# Altium project PCB_Clock.PrjPCB
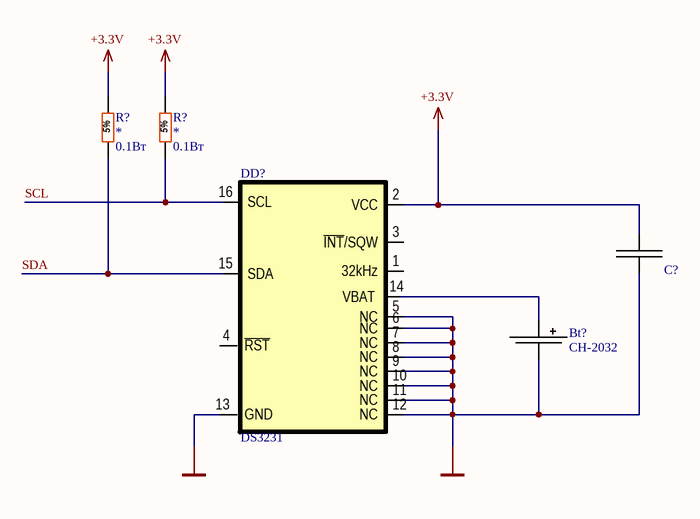
[diagram p0: clock_DS.SchDoc]
4 sheets, 118 parts. Net scope: global (net labels, ports and power ports of the same name join across sheets).
Sheets:
  clock_DS.SchDoc
  LED_MAX.SchDoc
  MPU_SHC.SchDoc
  DC_DCConverter.SchDoc

## Sheet clock_DS.SchDoc
size 209 x 297 mm; Address1: Address1; Address2: Address2; Address3: Address3; Address4: Address4; SheetNumber: 1; Scale: 1:1; Разраб.: Иванов; Обозначение документа: АБВГ.123456.001 Э3; Пров.: Петров; Утв.: Сидоров; Наименование организации: ОАО "Концерн "МПО-Гидроприбор"; Перв. применение: АБВГ.123456.000; Наименование изделия 1: Плата; Наименование изделия 2: Схема электрическая; Наименование изделия 3: принципиальная; Нач. отд.: Нач. отд.; Фамилия нач. отд.: Сидоров

### Parts
(Parts that share a designator on the sheet are numbered #1, #2 ... from top to bottom, then left to right.)
Bt?  CH-2032  [CH25-2032]
C?#1  *  [CH0603L]  (value not drawn)
DD?#1  DS3231  [16-SOIC (W)]
R?#1  Power: 0.1Вт  [Res0603]  (hidden comment: *)
R?#2  Power: 0.1Вт  [Res0603]  (hidden comment: *)

### Nets
+3.3V: C?#1.1 DD?#1.2(VCC) R?#1.2 R?#2.2
GND: Bt?.2 C?#1.2 DD?#1.5(NC) DD?#1.6(NC) DD?#1.7(NC) DD?#1.8(NC) DD?#1.9(NC) DD?#1.10(NC) DD?#1.11(NC) DD?#1.12(NC) DD?#1.13(GND)
SCL: DD?#1.16(SCL) R?#2.1
SDA: DD?#1.15(SDA) R?#1.1
NetBt?_1: Bt?.1 DD?#1.14(VBAT)

Not connected (* = marked no-connect by the designer): DD?#1 1(32kHz) 3(~{INT}/SQW) 4(~{RST})

### Notes on the sheet
- Перв. примен.
- Справ. №
- Подп. и дата
- Инв. № дубл.
- Взам. инв. №
- Разраб.
- Изм.
- Лист
- № докум.
- Подп.
- Дата
- Лит.
- Масса
- Масштаб
- Пров.
- Т.контр.
- Листов
- Инв. № подл.
- Утв.
- Н.контр.
- 2.106-A4
- Копировал
- Формат А4

### Library data of the parts
Bt? = CR-2032: Value: *; Quantity: *; Part Number: *; Manufacturer: *; Package: *; Price: *; ShoppingPlace: *; Documentation: *; Type: Bt
C?#1 = Capasitor: Value: *; Voltage: *; Part Number: *; Quantity: *; Package: *; Price: *; Manufacturer: *; ShoppingPlace: *
DD?#1 = DS3231: Manufacturer: MAXIM; Part Number: DS3231; Package: SO-16; Quantity: 1; Tolerance: *; Type: IC; Voltage: *; Power: *
R?#1 R?#2 = Res0603_5%: Voltage: 50В; Tolerance: 5%; Manufacturer: *; Quntity: *; Price: *; Part Number: *; Package: 0603; Doc: *; Value: *

## Sheet LED_MAX.SchDoc
size 420 x 297 mm; Address1: Address1; Address2: Address2; Address3: Address3; Address4: Address4; SheetNumber: 1; Scale: 1:1; Разраб.: Иванов; Обозначение документа: АБВГ.123456.001 Э3; Пров.: Петров; Утв.: Сидоров; Наименование организации: ОАО "Концерн "МПО-Гидроприбор"; Перв. применение: АБВГ.123456.000; Наименование изделия 1: Плата; Наименование изделия 2: Схема электрическая; Наименование изделия 3: принципиальная; Нач. отд.: Нач. отд.; Фамилия нач. отд.: Сидоров
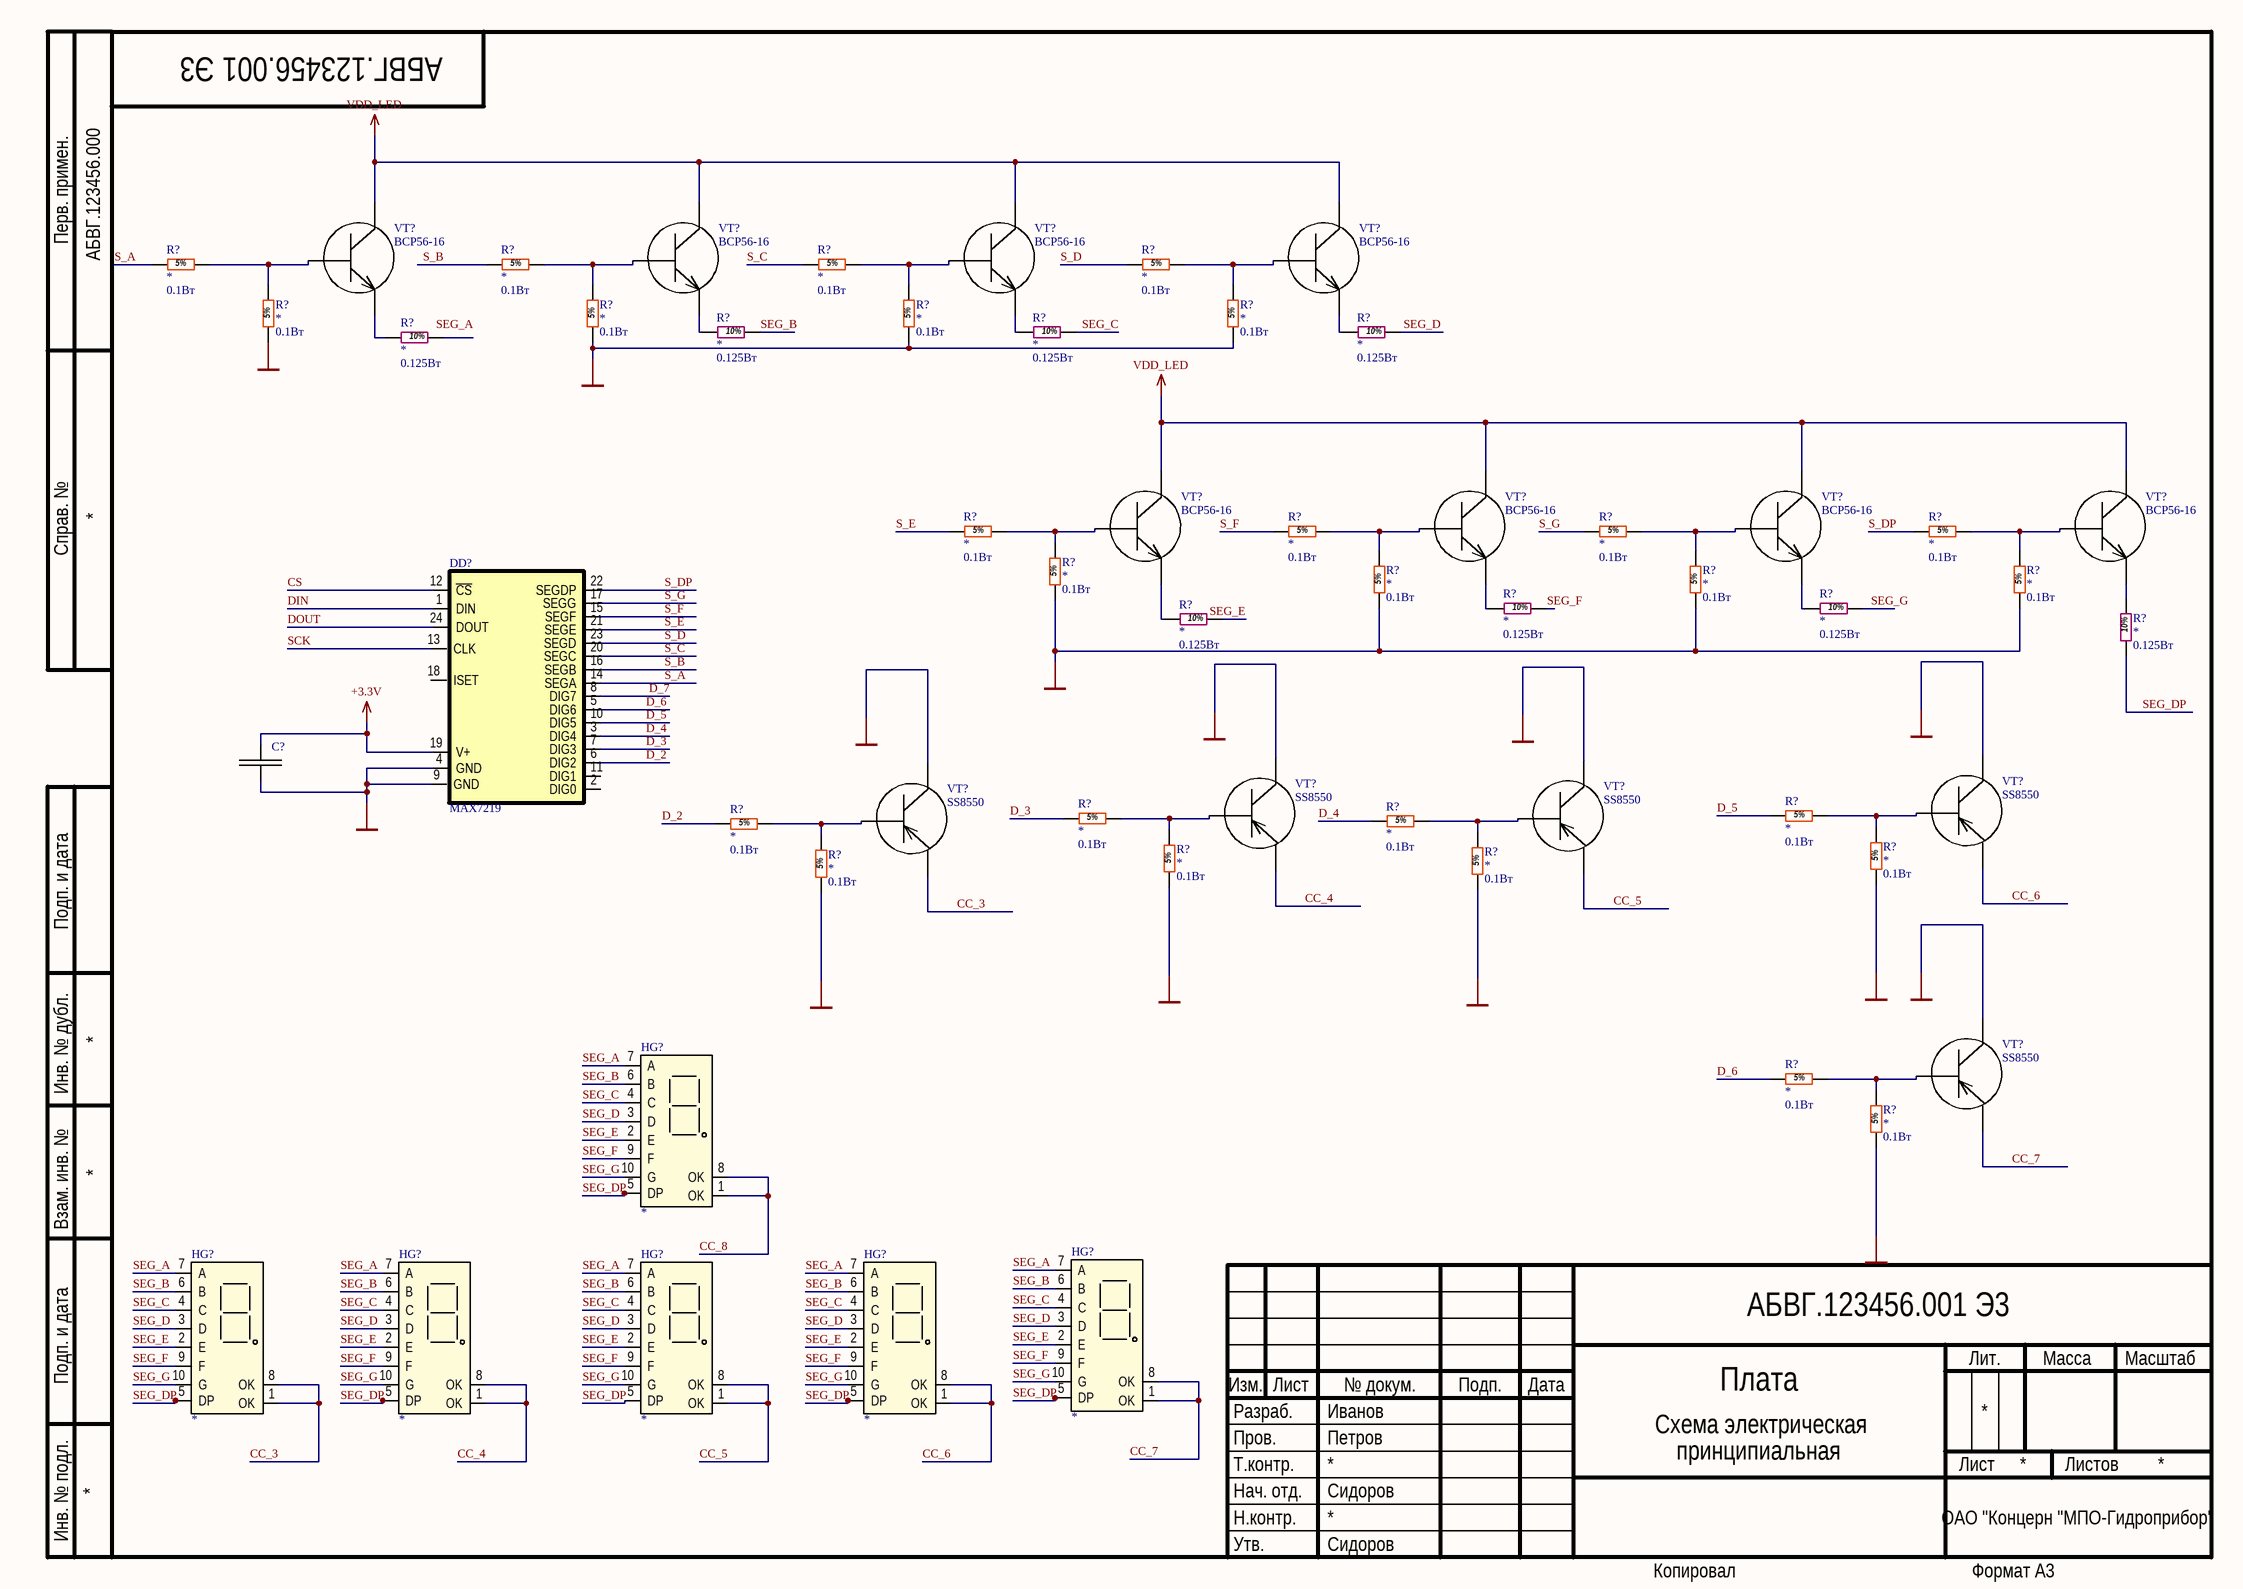
[diagram p1: LED_MAX.SchDoc]

### Parts
(Parts that share a designator on the sheet are numbered #1, #2 ... from top to bottom, then left to right.)
C?#2  *  [CH0603L]  (value not drawn)
DD?#2  MAX7219  [SO-24]
HG?#1  *  [FYS-40011]
HG?#2  *  [FYS-40011]
HG?#3  *  [FYS-40011]
HG?#4  *  [FYS-40011]
HG?#5  *  [FYS-40011]
HG?#6  *  [FYS-40011]
R?#3  Power: 0.1Вт  [Res0603]  (hidden comment: *)
R?#4  Power: 0.1Вт  [Res0603]  (hidden comment: *)
R?#5  Power: 0.1Вт  [Res0603]  (hidden comment: *)
R?#6  Power: 0.1Вт  [Res0603]  (hidden comment: *)
R?#7  Power: 0.1Вт  [Res0603]  (hidden comment: *)
R?#8  Power: 0.1Вт  [Res0603]  (hidden comment: *)
R?#9  Power: 0.1Вт  [Res0603]  (hidden comment: *)
R?#10  Power: 0.1Вт  [Res0603]  (hidden comment: *)
R?#11  Power: 0.125Вт  [RES0805]  (hidden comment: *)
R?#12  Power: 0.125Вт  [RES0805]  (hidden comment: *)
R?#13  Power: 0.125Вт  [RES0805]  (hidden comment: *)
R?#14  Power: 0.125Вт  [RES0805]  (hidden comment: *)
R?#15  Power: 0.1Вт  [Res0603]  (hidden comment: *)
R?#16  Power: 0.1Вт  [Res0603]  (hidden comment: *)
R?#17  Power: 0.1Вт  [Res0603]  (hidden comment: *)
R?#18  Power: 0.1Вт  [Res0603]  (hidden comment: *)
R?#19  Power: 0.1Вт  [Res0603]  (hidden comment: *)
R?#20  Power: 0.1Вт  [Res0603]  (hidden comment: *)
R?#21  Power: 0.1Вт  [Res0603]  (hidden comment: *)
R?#22  Power: 0.1Вт  [Res0603]  (hidden comment: *)
R?#23  Power: 0.125Вт  [RES0805]  (hidden comment: *)
R?#24  Power: 0.125Вт  [RES0805]  (hidden comment: *)
R?#25  Power: 0.125Вт  [RES0805]  (hidden comment: *)
R?#26  Power: 0.125Вт  [RES0805]  (hidden comment: *)
R?#27  Power: 0.1Вт  [Res0603]  (hidden comment: *)
R?#28  Power: 0.1Вт  [Res0603]  (hidden comment: *)
R?#29  Power: 0.1Вт  [Res0603]  (hidden comment: *)
R?#30  Power: 0.1Вт  [Res0603]  (hidden comment: *)
R?#31  Power: 0.1Вт  [Res0603]  (hidden comment: *)
R?#32  Power: 0.1Вт  [Res0603]  (hidden comment: *)
R?#33  Power: 0.1Вт  [Res0603]  (hidden comment: *)
R?#34  Power: 0.1Вт  [Res0603]  (hidden comment: *)
R?#35  Power: 0.1Вт  [Res0603]  (hidden comment: *)
R?#36  Power: 0.1Вт  [Res0603]  (hidden comment: *)
VT?#1  BCP56-16  [SOT223]
VT?#2  BCP56-16  [SOT223]
VT?#3  BCP56-16  [SOT223]
VT?#4  BCP56-16  [SOT223]
VT?#5  BCP56-16  [SOT223]
VT?#6  BCP56-16  [SOT223]
VT?#7  BCP56-16  [SOT223]
VT?#8  BCP56-16  [SOT223]
VT?#9  SS8550  [SOT23-3]
VT?#10  SS8550  [SOT23-3]
VT?#11  SS8550  [SOT23-3]
VT?#12  SS8550  [SOT23-3]
VT?#13  SS8550  [SOT23-3]

### Nets
+3.3V: C?#2.1 DD?#2.19(V+)
GND: C?#2.2 DD?#2.4(GND) DD?#2.9(GND) R?#7.1 R?#8.1 R?#9.1 R?#10.1 R?#19.1 R?#20.1 R?#21.1 R?#22.1 R?#31.1 R?#32.1 R?#33.1 R?#34.1 R?#36.1 VT?#9.3 VT?#10.3 VT?#11.3 VT?#12.3 VT?#13.3
VDD_LED: VT?#1.2 VT?#2.2 VT?#3.2 VT?#4.2 VT?#5.2 VT?#6.2 VT?#7.2 VT?#8.2
CC_3: HG?#2.1(OK) HG?#2.8(OK) VT?#11.2
CC_4: HG?#3.1(OK) HG?#3.8(OK) VT?#9.2
CC_5: HG?#4.1(OK) HG?#4.8(OK) VT?#12.2
CC_6: HG?#5.1(OK) HG?#5.8(OK) VT?#10.2
CC_7: HG?#6.1(OK) HG?#6.8(OK) VT?#13.2
CC_8: HG?#1.1(OK) HG?#1.8(OK)
CS: DD?#2.12(~{CS})
D_2: DD?#2.6(DIG2) R?#28.1
D_3: DD?#2.7(DIG3) R?#29.1
D_4: DD?#2.3(DIG4) R?#30.1
D_5: DD?#2.10(DIG5) R?#27.1
D_6: DD?#2.5(DIG6) R?#35.1
D_7: DD?#2.8(DIG7)
DIN: DD?#2.1(DIN)
DOUT: DD?#2.24(DOUT)
S_A: DD?#2.14(SEGA) R?#3.1
S_B: DD?#2.16(SEGB) R?#4.1
S_C: DD?#2.20(SEGC) R?#5.1
S_D: DD?#2.23(SEGD) R?#6.1
S_DP: DD?#2.22(SEGDP) R?#18.1
S_E: DD?#2.21(SEGE) R?#15.1
S_F: DD?#2.15(SEGF) R?#16.1
S_G: DD?#2.17(SEGG) R?#17.1
SCK: DD?#2.13(CLK)
SEG_A: HG?#1.7(A) HG?#2.7(A) HG?#3.7(A) HG?#4.7(A) HG?#5.7(A) HG?#6.7(A)
SEG_B: HG?#1.6(B) HG?#2.6(B) HG?#3.6(B) HG?#4.6(B) HG?#5.6(B) HG?#6.6(B) R?#12.2
SEG_C: HG?#1.4(C) HG?#2.4(C) HG?#3.4(C) HG?#4.4(C) HG?#5.4(C) HG?#6.4(C) R?#13.2
SEG_D: HG?#1.3(D) HG?#2.3(D) HG?#3.3(D) HG?#4.3(D) HG?#5.3(D) HG?#6.3(D) R?#14.2
SEG_DP: HG?#1.5(DP) HG?#2.5(DP) HG?#3.5(DP) HG?#4.5(DP) HG?#5.5(DP) HG?#6.5(DP) R?#26.1
SEG_E: HG?#1.2(E) HG?#2.2(E) HG?#3.2(E) HG?#4.2(E) HG?#5.2(E) HG?#6.2(E)
SEG_F: HG?#1.9(F) HG?#2.9(F) HG?#3.9(F) HG?#4.9(F) HG?#5.9(F) HG?#6.9(F) R?#23.2
SEG_G: HG?#1.10(G) HG?#2.10(G) HG?#3.10(G) HG?#4.10(G) HG?#5.10(G) HG?#6.10(G) R?#24.2
NetR?#3_2: R?#3.2 R?#7.2 VT?#1.1
NetR?#4_2: R?#4.2 R?#8.2 VT?#2.1
NetR?#5_2: R?#5.2 R?#9.2 VT?#3.1
NetR?#6_2: R?#6.2 R?#10.2 VT?#4.1
NetR?#11_1: R?#11.1 VT?#1.3
NetR?#12_1: R?#12.1 VT?#2.3
NetR?#13_1: R?#13.1 VT?#3.3
NetR?#14_1: R?#14.1 VT?#4.3
NetR?#15_2: R?#15.2 R?#19.2 VT?#5.1
NetR?#16_2: R?#16.2 R?#20.2 VT?#6.1
NetR?#17_2: R?#17.2 R?#21.2 VT?#7.1
NetR?#18_2: R?#18.2 R?#22.2 VT?#8.1
NetR?#23_1: R?#23.1 VT?#6.3
NetR?#24_1: R?#24.1 VT?#7.3
NetR?#25_1: R?#25.1 VT?#5.3
NetR?#26_2: R?#26.2 VT?#8.3
NetR?#27_2: R?#27.2 R?#32.2 VT?#10.1
NetR?#28_2: R?#28.2 R?#33.2 VT?#11.1
NetR?#29_2: R?#29.2 R?#31.2 VT?#9.1
NetR?#30_2: R?#30.2 R?#34.2 VT?#12.1
NetR?#35_2: R?#35.2 R?#36.2 VT?#13.1

Not connected (* = marked no-connect by the designer): DD?#2 2(DIG0) 11(DIG1) 18(ISET); R?#11 2; R?#25 2

### Notes on the sheet
- Labels drawn without touching a wire or pin: SEG_A, SEG_E
- Перв. примен.
- Справ. №
- Подп. и дата
- Инв. № дубл.
- Взам. инв. №
- Разраб.
- Изм.
- Лист
- № докум.
- Подп.
- Дата
- Лит.
- Масса
- Масштаб
- Пров.
- Т.контр.
- Листов
- Инв. № подл.
- Утв.
- Н.контр.
- Копировал
- Формат А3

### Library data of the parts
C?#2 = Capasitor: Value: *; Voltage: *; Part Number: *; Quantity: *; Package: *; Price: *; Manufacturer: *; ShoppingPlace: *
DD?#2 = MAX7219: Manufacturer: MAXIM; Part Number: MAX7219; Package: SO-24; Quantity: 1; Tolerance: *; Type: IC; Voltage: *; Power: *
HG?#1-HG?#6 = LED Indicator: Value: *; Quantity: *; Part Number: *; Manufacturer: *; Package: *; Price: *; ShoppingPlace: *; Documentation: *; Type: HG
R?#3-R?#10 R?#15-R?#22 R?#27-R?#36 = Res0603_5%: Voltage: 50В; Tolerance: 5%; Manufacturer: *; Quntity: *; Price: *; Part Number: *; Package: 0603; Doc: *; Value: *
R?#11-R?#14 R?#23-R?#26 = Res0805_10%: Voltage: 150В; Tolerance: 10%; Manufacturer: *; Quntity: *; Price: *; Part Number: *; Package: 0805; Doc: *; Value: *
VT?#1-VT?#8 = BCP56-16: Manufacturer: NXP Semiconductors; Value: 80V,1A; Part Number: BCP56-16; Price: BCP56; Quantity: 2; Documentation: https://assets.nexperia.com/documents/data-sheet/BCP56_BCX56_BC56PA.pdf
VT?#9-VT?#13 = SS8550: Manufacturer: NXP; Value: 45V,100mA; Part Number: SS8550; Price: 1; ShoppingPlace: https://belchip.by/product/?selected_product=29133; Quantity: 1; Package: SOT-23; Documentation: https://belchip.by/sitedocs/ss8550.pdf

## Sheet MPU_SHC.SchDoc
size 420 x 297 mm; Address1: Address1; Address2: Address2; Address3: Address3; Address4: Address4; SheetNumber: 1; Scale: 1:1; Разраб.: Иванов; Обозначение документа: АБВГ.123456.001 Э3; Пров.: Петров; Утв.: Сидоров; Наименование организации: ОАО "Концерн "МПО-Гидроприбор"; Перв. применение: АБВГ.123456.000; Наименование изделия 1: Плата; Наименование изделия 2: Схема электрическая; Наименование изделия 3: принципиальная; Нач. отд.: Нач. отд.; Фамилия нач. отд.: Сидоров
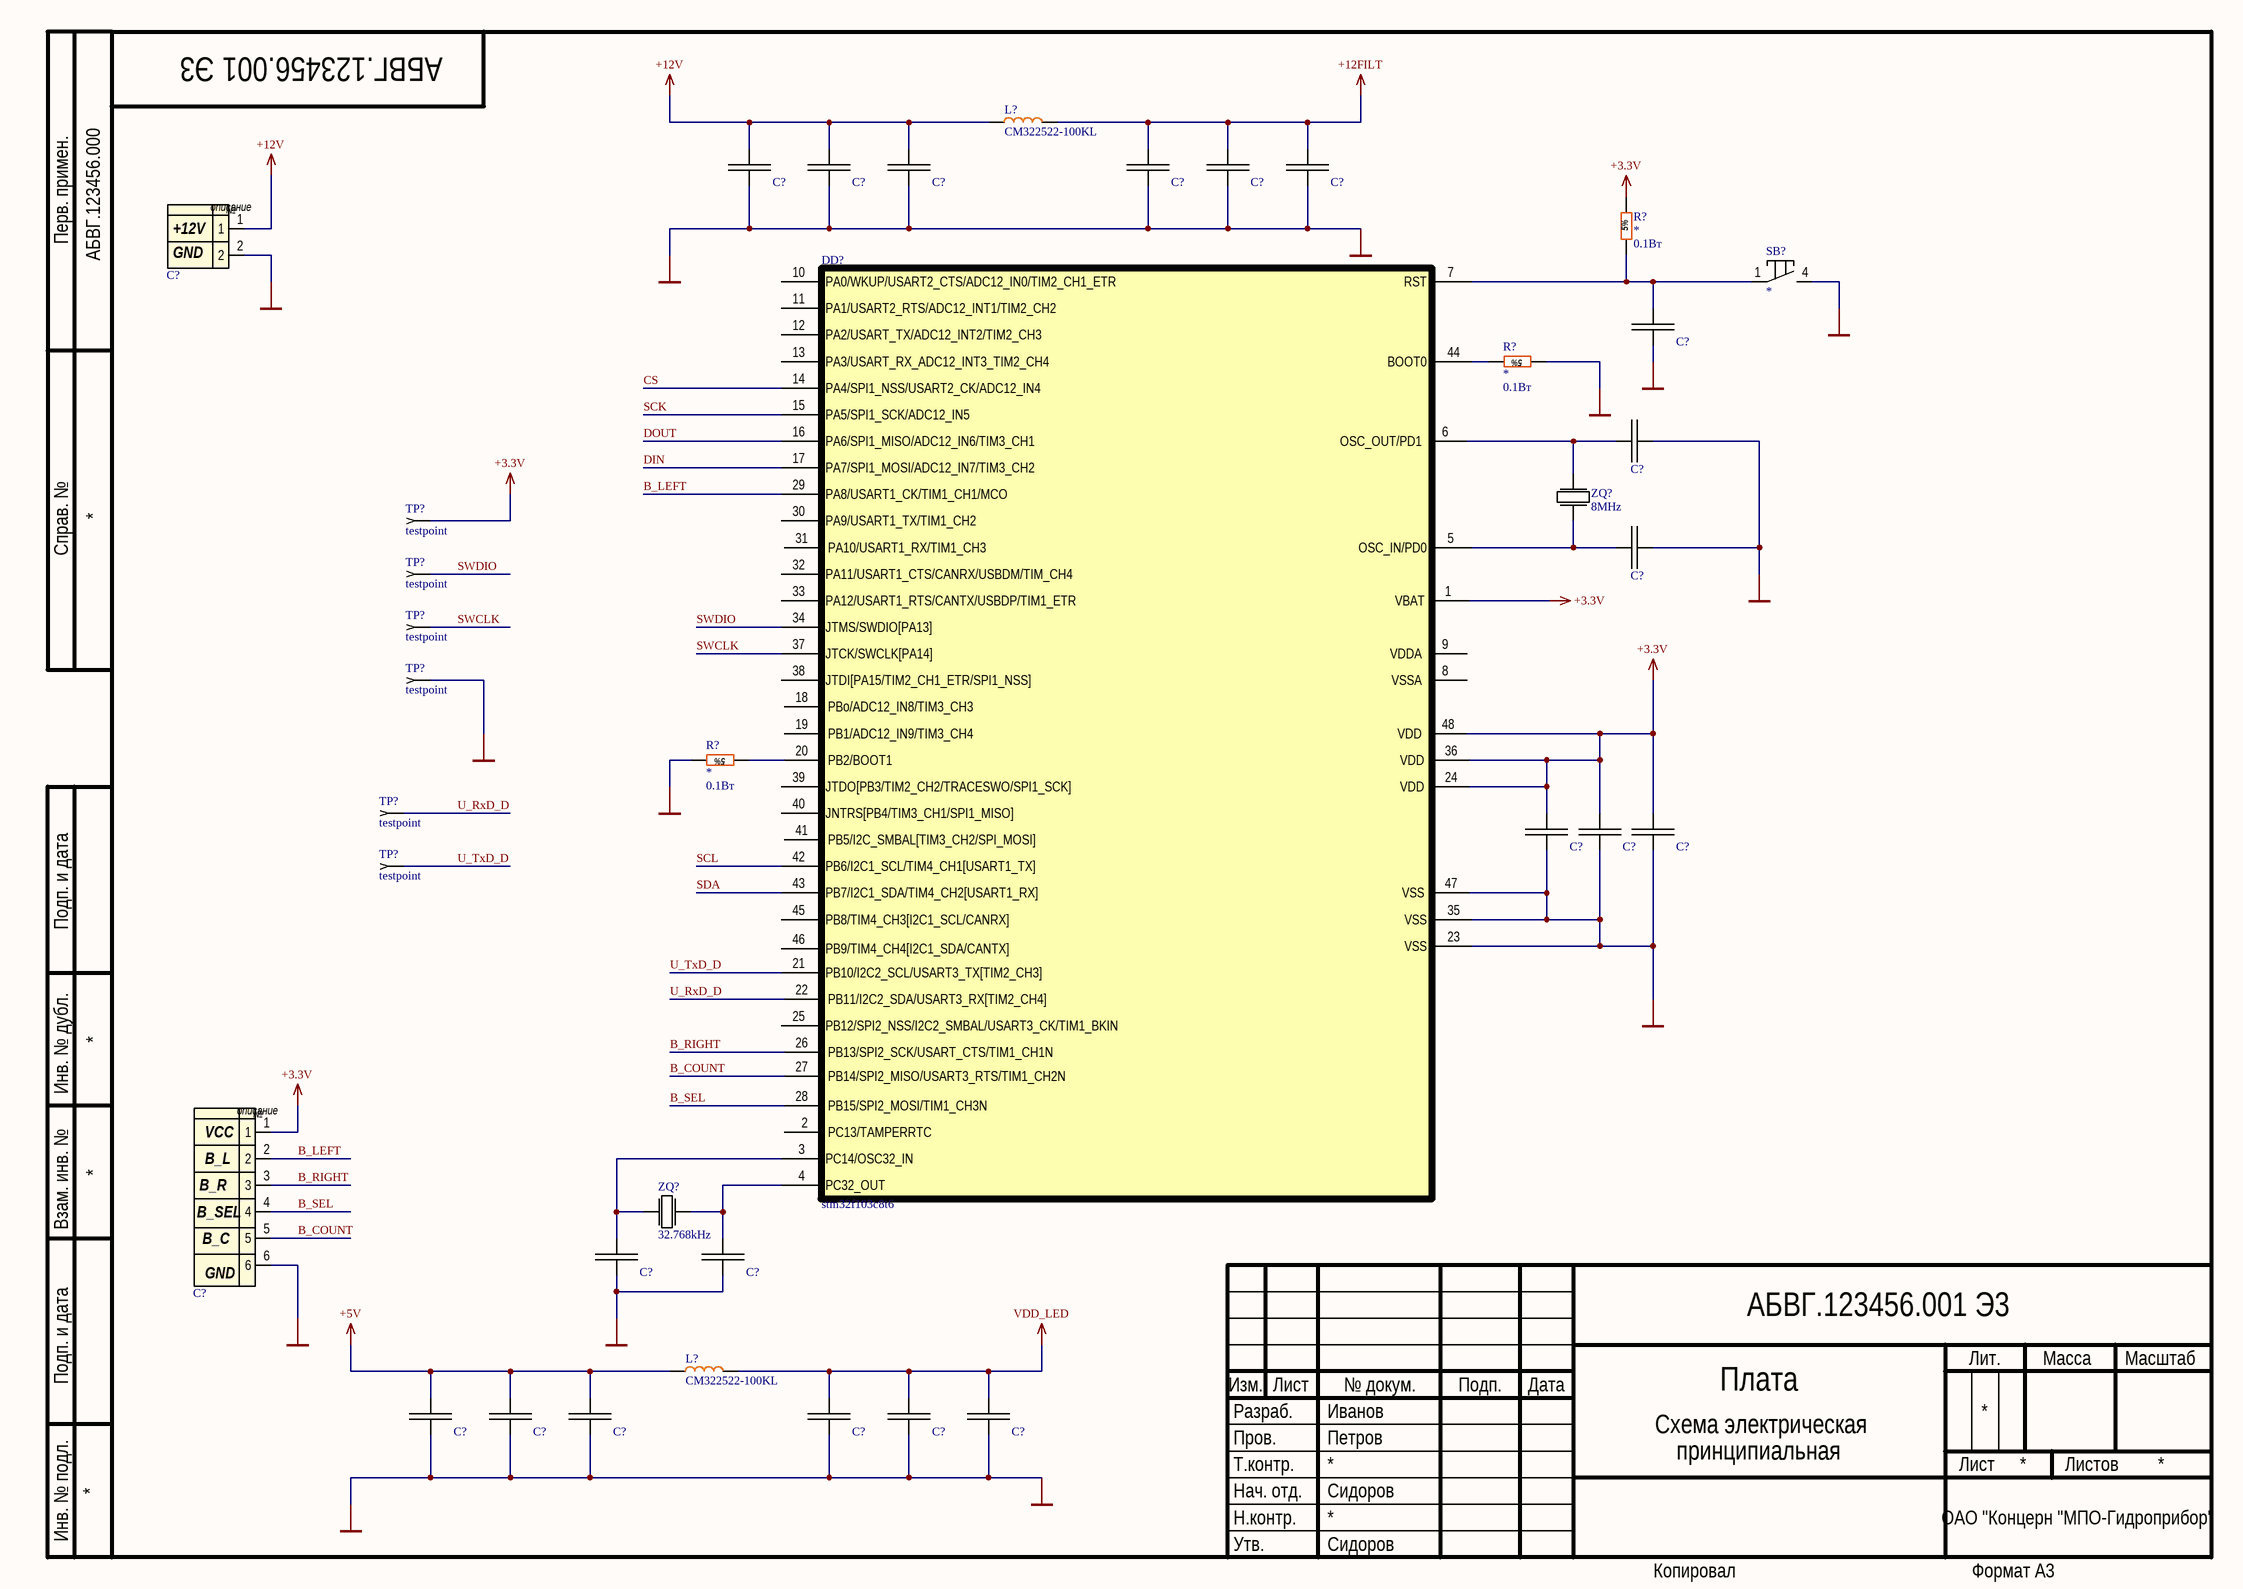
[diagram p2: MPU_SHC.SchDoc]

### Parts
(Parts that share a designator on the sheet are numbered #1, #2 ... from top to bottom, then left to right.)
C?#3  *  [CH0603L]  (value not drawn)
C?#4  *  [CH0805C]  (value not drawn)
C?#5  *  [CAP1206]  (value not drawn)
C?#6  *  [CH0603L]  (value not drawn)
C?#7  *  [CH0805C]  (value not drawn)
C?#8  *  [CAP1206]  (value not drawn)
C?#9  DS1069-2 MR-A  [DS1069-2]  (value not drawn)
C?#10  *  [CH0603L]  (value not drawn)
C?#11  *  [CH0603L]  (value not drawn)
C?#12  *  [CH0603L]  (value not drawn)
C?#13  *  [CH0603L]  (value not drawn)
C?#14  *  [CH0603L]  (value not drawn)
C?#15  *  [CH0603L]  (value not drawn)
C?#16  DS1069-6 MR-A_1  [DS1069-6 MR-A]  (value not drawn)
C?#17  *  [CH0603L]  (value not drawn)
C?#18  *  [CH0603L]  (value not drawn)
C?#19  *  [CH0603L]  (value not drawn)
C?#20  *  [CH0805C]  (value not drawn)
C?#21  *  [CAP1206]  (value not drawn)
C?#22  *  [CH0603L]  (value not drawn)
C?#23  *  [CH0805C]  (value not drawn)
C?#24  *  [CAP1206]  (value not drawn)
DD?#3  stm32f103c8t6  [48-LQFP]
L?#1  CM322522-100KL  [1210]
L?#2  CM322522-100KL  [1210]
R?#37  Power: 0.1Вт  [Res0603]  (hidden comment: *)
R?#38  Power: 0.1Вт  [Res0603]  (hidden comment: *)
R?#39  Power: 0.1Вт  [Res0603]  (hidden comment: *)
SB?  *  [KLS2]
TP?#1  testpoint  [testpoint]
TP?#2  testpoint  [testpoint]
TP?#3  testpoint  [testpoint]
TP?#4  testpoint  [testpoint]
TP?#5  testpoint  [testpoint]
TP?#6  testpoint  [testpoint]
ZQ?#1  8MHz  [SMD0503]
ZQ?#2  32.768kHz  [smd03215c2]

### Nets
+3.3V: C?#13.1 C?#14.1 C?#15.1 C?#16.1 DD?#3.1(VBAT) DD?#3.24(VDD) DD?#3.36(VDD) DD?#3.48(VDD) R?#37.2 TP?#1.1
+5V: C?#19.1 C?#20.1 C?#21.1 L?#2.1(SENSE)
+12FILT: C?#6.1 C?#7.1 C?#8.1 L?#1.2(GND)
+12V: C?#3.1 C?#4.1 C?#5.1 C?#9.1 L?#1.1(SENSE)
GND: C?#3.2 C?#4.2 C?#5.2 C?#6.2 C?#7.2 C?#8.2 C?#9.2 C?#10.1 C?#11.2 C?#12.2 C?#13.2 C?#14.2 C?#15.2 C?#16.6 C?#17.2 C?#18.2 C?#19.2 C?#20.2 C?#21.2 C?#22.2 C?#23.2 C?#24.2 DD?#3.23(VSS) DD?#3.35(VSS) DD?#3.47(VSS) R?#38.1 R?#39.2 SB?.4 TP?#4.1
VDD_LED: C?#22.1 C?#23.1 C?#24.1 L?#2.2(GND)
B_COUNT: C?#16.5 DD?#3.27(PB14/SPI2_MISO/USART3_RTS/TIM1_CH2N)
B_LEFT: C?#16.2 DD?#3.29(PA8/USART1_CK/TIM1_CH1/MCO)
B_RIGHT: C?#16.3 DD?#3.26(PB13/SPI2_SCK/USART_CTS/TIM1_CH1N)
B_SEL: C?#16.4 DD?#3.28(PB15/SPI2_MOSI/TIM1_CH3N)
CS: DD?#3.14(PA4/SPI1_NSS/USART2_CK/ADC12_IN4)
DIN: DD?#3.17(PA7/SPI1_MOSI/ADC12_IN7/TIM3_CH2)
DOUT: DD?#3.16(PA6/SPI1_MISO/ADC12_IN6/TIM3_CH1)
SCK: DD?#3.15(PA5/SPI1_SCK/ADC12_IN5)
SCL: DD?#3.42(PB6/I2C1_SCL/TIM4_CH1[USART1_TX])
SDA: DD?#3.43(PB7/I2C1_SDA/TIM4_CH2[USART1_RX])
SWCLK: DD?#3.37(JTCK/SWCLK[PA14]) TP?#3.1
SWDIO: DD?#3.34(JTMS/SWDIO[PA13]) TP?#2.1
U_RxD_D: DD?#3.22(PB11/I2C2_SDA/USART3_RX[TIM2_CH4]) TP?#5.1
U_TxD_D: DD?#3.21(PB10/I2C2_SCL/USART3_TX[TIM2_CH3]) TP?#6.1
NetC?#10_2: C?#10.2 DD?#3.7(RST) R?#37.1 SB?.1
NetC?#11_1: C?#11.1 DD?#3.6(OSC_OUT/PD1) ZQ?#1.3
NetC?#12_1: C?#12.1 DD?#3.5(OSC_IN/PD0) ZQ?#1.1
NetC?#17_1: C?#17.1 DD?#3.3(PC14/OSC32_IN) ZQ?#2.1
NetC?#18_1: C?#18.1 DD?#3.4(PC32_OUT) ZQ?#2.2
NetDD?#3_20: DD?#3.20(PB2/BOOT1) R?#39.1
NetDD?#3_44: DD?#3.44(BOOT0) R?#38.2

Not connected (* = marked no-connect by the designer): DD?#3 2(PC13/TAMPERRTC) 8(VSSA) 9(VDDA) 10(PA0/WKUP/USART2_CTS/ADC12_IN0/TIM2_CH1_ETR) 11(PA1/USART2_RTS/ADC12_INT1/TIM2_CH2) 12(PA2/USART_TX/ADC12_INT2/TIM2_CH3) 13(PA3/USART_RX_ADC12_INT3_TIM2_CH4) 18(PBo/ADC12_IN8/TIM3_CH3) 19(PB1/ADC12_IN9/TIM3_CH4) 25(PB12/SPI2_NSS/I2C2_SMBAL/USART3_CK/TIM1_BKIN) 30(PA9/USART1_TX/TIM1_CH2) 31(PA10/USART1_RX/TIM1_CH3) 32(PA11/USART1_CTS/CANRX/USBDM/TIM_CH4) 33(PA12/USART1_RTS/CANTX/USBDP/TIM1_ETR) 38(JTDI[PA15/TIM2_CH1_ETR/SPI1_NSS]) 39(JTDO[PB3/TIM2_CH2/TRACESWO/SPI1_SCK]) 40(JNTRS[PB4/TIM3_CH1/SPI1_MISO]) 41(PB5/I2C_SMBAL[TIM3_CH2/SPI_MOSI]) 45(PB8/TIM4_CH3[I2C1_SCL/CANRX]) 46(PB9/TIM4_CH4[I2C1_SDA/CANTX])

### Notes on the sheet
- (near C?#9) +12V
- (near C?#9) GND
- (near C?#16) VCC
- (near C?#16) B_R
- (near C?#16) B_L
- (near C?#16) B_SEL
- (near C?#16) B_C
- (near C?#16) GND
- Перв. примен.
- Справ. №
- Подп. и дата
- Инв. № дубл.
- Взам. инв. №
- Разраб.
- Изм.
- Лист
- № докум.
- Подп.
- Дата
- Лит.
- Масса
- Масштаб
- Пров.
- Т.контр.
- Листов
- Инв. № подл.
- Утв.
- Н.контр.
- Копировал
- Формат А3
- (in symbol DS1069-2 MR-A) описание; №
- (in symbol DS1069-6 MR-A) описание; №

### Library data of the parts
C?#3-C?#8 C?#10-C?#15 C?#17-C?#24 = Capasitor: Value: *; Voltage: *; Part Number: *; Quantity: *; Package: *; Price: *; Manufacturer: *; ShoppingPlace: *
C?#9 = DS1069-2 MR-A: Manufacturer: Ningbo connfly electronic; Value: 1A; Voltage: 250V; Part Number: DS1069-2 MR-A; Quantity: 1; Package: DS1069-2- 2.5mm; Price: 0,18; ShoppingPlace: https://www.ru-chipdip.by/product/cwf-2r-ds1069-2-mr; Ответная часть: https://www.ru-chipdip.by/product/chu-2
C?#16 = DS1069-6 MR-A: Manufacturer: Ningbo connfly electronic; Value: 1A; Voltage: 250V; Part Number: DS1069-6 MR-A_1; Quantity: 1; Package: DS1069-6 MR-A_1- 2.5mm; Price: 0,18; ShoppingPlace: https://www.ru-chipdip.by/product/cwf-6r-ds1069-6-mr; Ответная часть: https://www.ru-chipdip.by/product/chu-6
DD?#3 = stm32f103c8t6: Manufacturer: STM; Part Number: stm32f103c8t6; Package: LQFP48; Quantity: 1; Tolerance: *; Type: IC; Voltage: *; Power: *
L?#1 L?#2 = CM322522-100KL: Manufacturer: Bourns; Value: 10uГн; Tolerance: +-10%; Type: L; Power: 140mA; Part Number: CM322522-100KL; Price: 0,35; ShoppingPlace: https://www.ru-chipdip.by/product/cm322522-100kl; Package: 1210; Quantity: 1; Voltage: *; Documentation: http://www.farnell.com/datasheets/2360599.pdf
R?#37-R?#39 = Res0603_5%: Voltage: 50В; Tolerance: 5%; Manufacturer: *; Quntity: *; Price: *; Part Number: *; Package: 0603; Doc: *; Value: *
SB? = Button: Part Number: *; Price: *; Value: *; ShoppingPlace: *; Quantity: *; Package: *; Manufacturer: *; Documantation: *; Type: SB
TP?#1-TP?#6 = P
ZQ?#1 = SMD0503: Voltage: China; Part Number: SMD0503; Price: 1,2; ShoppingPlace: https://www.ru-chipdip.by/product0/9000341671; Package: SMD0503; Value: 8MHz; Quantity: 1; Type: ZQ; Documentation: https://static.chipdip.ru/lib/652/DOC001652773.pdf
ZQ?#2 = FC-135: Voltage: China; Part Number: FC-135; Price: 0,90; ShoppingPlace: https://www.ru-chipdip.by/product0/9000372611; Package: smd03215c2; Value: 32.768kHz; Quantity: 1; Type: ZQ; Documentation: https://static.chipdip.ru/lib/484/DOC001484714.pdf

## Sheet DC_DCConverter.SchDoc
size 420 x 297 mm; Address1: Address1; Address2: Address2; Address3: Address3; Address4: Address4; SheetNumber: 1; Scale: 1:1; Разраб.: Иванов; Обозначение документа: АБВГ.123456.001 Э3; Пров.: Петров; Утв.: Сидоров; Наименование организации: ОАО "Концерн "МПО-Гидроприбор"; Перв. применение: АБВГ.123456.000; Наименование изделия 1: Плата; Наименование изделия 2: Схема электрическая; Наименование изделия 3: принципиальная; Нач. отд.: Нач. отд.; Фамилия нач. отд.: Сидоров
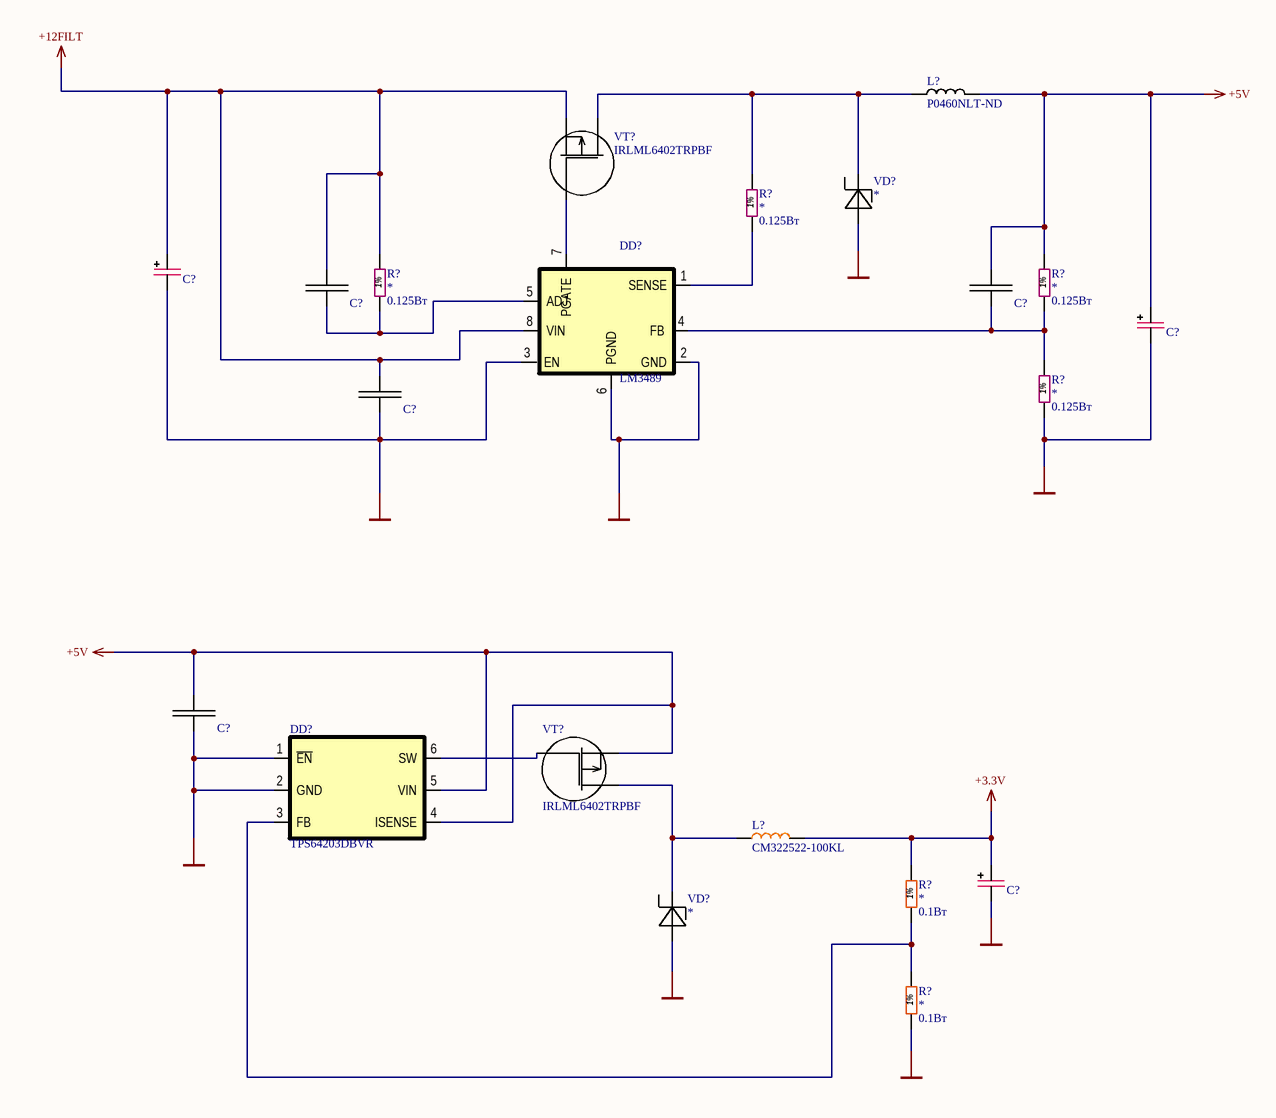
[diagram p3: DC_DCConverter.SchDoc]

### Parts
(Parts that share a designator on the sheet are numbered #1, #2 ... from top to bottom, then left to right.)
C?#25  22uF  [D6.6C6.6H6.1]  (value not drawn)
C?#26  *  [CH0805C]  (value not drawn)
C?#27  *  [CH0805C]  (value not drawn)
C?#28  *  [D6.6C6.6H6.1]  (value not drawn)
C?#29  *  [CH0805C]  (value not drawn)
C?#30  *  [CH0805C]  (value not drawn)
C?#31  *  [D6.6C6.6H6.1]  (value not drawn)
DD?#4  LM3489  [8-SSOP]
DD?#5  TPS64203DBVR  [SOT-23-6]
L?#3  P0460NLT-ND  [PG0936]
L?#4  CM322522-100KL  [1210]
R?#40  Power: 0.125Вт  [RES0805]  (hidden comment: *)
R?#41  Power: 0.125Вт  [RES0805]  (hidden comment: *)
R?#42  Power: 0.125Вт  [RES0805]  (hidden comment: *)
R?#43  Power: 0.125Вт  [RES0805]  (hidden comment: *)
R?#44  Power: 0.1Вт  [Res0603]  (hidden comment: *)
R?#45  Power: 0.1Вт  [Res0603]  (hidden comment: *)
VD?#1  *  [DO-214(SMB)]
VD?#2  *  [DO-214(SMB)]
VT?#14  IRLML6402TRPBF  [SOT23-3]
VT?#15  IRLML6402TRPBF  [SOT23-3]

### Nets
+3.3V: C?#31.1 L?#4.2(GND) R?#44.2
+5V: C?#27.1 C?#28.1 C?#30.1 DD?#5.4(ISENSE) DD?#5.5(VIN) L?#3.2(GND) R?#42.2 VT?#15.2(Source)
+12FILT: C?#25.1 C?#26.1 C?#29.1 DD?#4.8(VIN) R?#41.2 VT?#14.2(Source)
GND: C?#25.2 C?#28.2 C?#29.2 C?#30.2 C?#31.2 DD?#4.2(GND) DD?#4.3(EN) DD?#4.6(PGND) DD?#5.1(~{EN}) DD?#5.2(GND) R?#43.1 R?#45.1 VD?#1.1 VD?#2.1
NetC?#26_2: C?#26.2 DD?#4.5(ADJ) R?#41.1
NetC?#27_2: C?#27.2 DD?#4.4(FB) R?#42.1 R?#43.2
NetDD?#4_1: DD?#4.1(SENSE) R?#40.1
NetDD?#4_7: DD?#4.7(PGATE) VT?#14.1(G)
NetDD?#5_3: DD?#5.3(FB) R?#44.1 R?#45.2
NetDD?#5_6: DD?#5.6(SW) VT?#15.1(G)
NetL?#3_1: L?#3.1(SENSE) R?#40.2 VD?#1.2 VT?#14.3(D)
NetL?#4_1: L?#4.1(SENSE) VD?#2.2 VT?#15.3(D)

### Notes on the sheet
- Перв. примен.
- Справ. №
- Подп. и дата
- Инв. № дубл.
- Взам. инв. №
- Разраб.
- Изм.
- Лист
- № докум.
- Подп.
- Дата
- Лит.
- Масса
- Масштаб
- Пров.
- Т.контр.
- Листов
- Инв. № подл.
- Утв.
- Н.контр.
- Копировал
- Формат А3

### Library data of the parts
C?#25 = Electrolitich_Capasitor: Part Number: ECAPSMD22uF/35V; Manufacturer: EPCOS; Voltage: 35V; Value: 22uF; Quantity: 50; Package: 6.3x5.4; Price: 0,25; ShoppingPlace: https://www.ru-chipdip.by/product0/20423?from=payattention_visited
C?#26 C?#27 C?#29 C?#30 = Capasitor: Value: *; Voltage: *; Part Number: *; Quantity: *; Package: *; Price: *; Manufacturer: *; ShoppingPlace: *
C?#28 C?#31 = Electrolitich_Capasitor: Value: *; Voltage: *; Part Number: *; Quantity: *; Package: *; Price: *; Manufacturer: *; ShoppingPlace: *
DD?#4 = LM3489: Manufacturer: Texas Instruments; Part Number: LM3489; ShoppingPlace: https://www.digikey.com/product-detail/en/texas-instruments/LM3489MMX-NOPB/296-35277-6-ND/3739282; Package: 8-TSSOP; Quantity: 1; Tolerance: *; Type: IC; Voltage: *; Power: *; Documentation: http://www.ti.com/lit/ds/symlink/lm3489.pdf
DD?#5 = TPS64203DBVR: Manufacturer: Texas Instruments; Part Number: TPS64203DBVR; ShoppingPlace: https://www.digikey.com/product-detail/en/texas-instruments/TPS64203DBVR/296-27036-2-ND/1672405; Package: SOT-23-6; Quantity: 1; Tolerance: *; Type: IC; Voltage: *; Power: *; Documentation: http://www.ti.com/lit/ds/symlink/tps64200.pdf
L?#3 = PG0936.253NL: Manufacturer: Pulse Electronics Power; Type: L; Part Number: PG0936.253NL; ShoppingPlace: https://www.digikey.com/product-detail/en/pulse-electronics-power/PG0936.253NL/553-3154-ND/5436640; Package: PG0936.253NL; Quantity: 1; Tolerance: *; Voltage: *; Power: *; Documentation: https://media.digikey.com/pdf/Data%20Sheets/Pulse%20PDFs/Ros1,2_Series.pdf
L?#4 = CM322522-100KL: as L?#1 on sheet MPU_SHC; Part Number: CM322522-100KL; Price: 0,35; ShoppingPlace: https://www.ru-chipdip.by/product/cm322522-100kl; Package: 1210; Quantity: 1; Voltage: *; Documentation: http://www.farnell.com/datasheets/2360599.pdf
R?#40-R?#43 = Res0805_1%: Voltage: 150В; Tolerance: 1%; Manufacturer: *; Quntity: *; Price: *; Part Number: *; Package: 0805; Doc: *; Value: *
R?#44 R?#45 = Res0603_1%: Voltage: 50В; Tolerance: 1%; Manufacturer: *; Quntity: *; Price: *; Part Number: *; Package: 0603; Doc: *; Value: *
VD?#1 VD?#2 = Basic_Diode_shottki: Part Number: *; Package: *; Value: *; Price: *; ShoppingPlace: *; Documantation: *
VT?#14 VT?#15 = IRLML6402: Manufacturer: International rectifier; Value: -20V,0,065Om; Package: SOT-23; Price: 0,17; Part Number: IRLML6402TRPBF; Quantity: 1; Documentation: https://www.infineon.com/dgdl/irlml6402pbf.pdf?fileId=5546d462533600a401535668d5c2263c

## Nets that join several sheets
+3.3V: clock_DS (C?#1.1 DD?#1.2 R?#1.2 R?#2.2), LED_MAX (C?#2.1 DD?#2.19), MPU_SHC (10 pins), DC_DCConverter (C?#31.1 L?#4.2 R?#44.2)
+5V: MPU_SHC (C?#19.1 C?#20.1 C?#21.1 L?#2.1), DC_DCConverter (8 pins)
+12FILT: MPU_SHC (C?#6.1 C?#7.1 C?#8.1 L?#1.2), DC_DCConverter (6 pins)
GND: clock_DS (11 pins), LED_MAX (21 pins), MPU_SHC (29 pins), DC_DCConverter (14 pins)
VDD_LED: LED_MAX (8 pins), MPU_SHC (C?#22.1 C?#23.1 C?#24.1 L?#2.2)
CS: LED_MAX (DD?#2.12), MPU_SHC (DD?#3.14)
DIN: LED_MAX (DD?#2.1), MPU_SHC (DD?#3.17)
DOUT: LED_MAX (DD?#2.24), MPU_SHC (DD?#3.16)
SCK: LED_MAX (DD?#2.13), MPU_SHC (DD?#3.15)
SCL: clock_DS (DD?#1.16 R?#2.1), MPU_SHC (DD?#3.42)
SDA: clock_DS (DD?#1.15 R?#1.1), MPU_SHC (DD?#3.43)